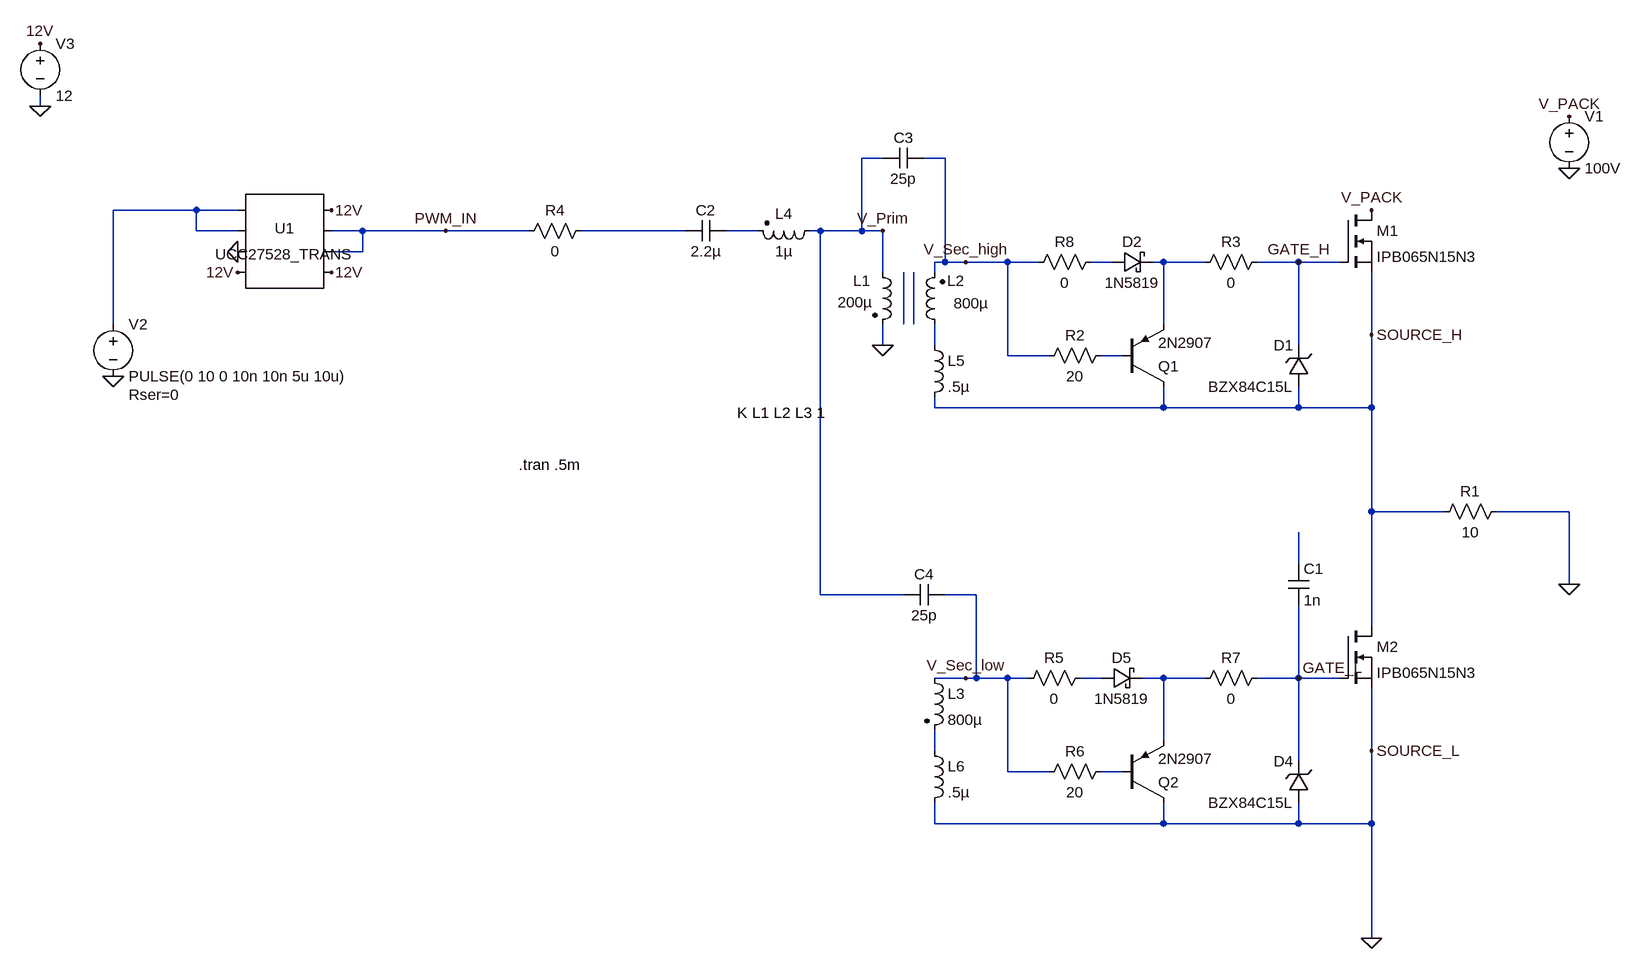
[diagram p0: schematic IsolatedGateDriver.asc]
IsolatedGateDriver.asc, the LTspice schematic file:
Version 4
SHEET 1 996 1044
WIRE -1440 -256 -1440 -272
WIRE -144 -176 -176 -176
WIRE -48 -176 -80 -176
WIRE -1200 -96 -1328 -96
WIRE -1136 -96 -1200 -96
WIRE -1200 -64 -1200 -96
WIRE -1136 -64 -1200 -64
WIRE -944 -64 -992 -64
WIRE -816 -64 -944 -64
WIRE -688 -64 -816 -64
WIRE -448 -64 -608 -64
WIRE -336 -64 -384 -64
WIRE -240 -64 -256 -64
WIRE -176 -64 -176 -176
WIRE -176 -64 -240 -64
WIRE -144 -64 -176 -64
WIRE -944 -32 -944 -64
WIRE -944 -32 -992 -32
WIRE -48 -16 -48 -176
WIRE -48 -16 -64 -16
WIRE -16 -16 -48 -16
WIRE 48 -16 -16 -16
WIRE 96 -16 48 -16
WIRE 208 -16 176 -16
WIRE 288 -16 272 -16
WIRE 352 -16 288 -16
WIRE 496 -16 432 -16
WIRE 560 -16 496 -16
WIRE -144 0 -144 -64
WIRE -64 0 -64 -16
WIRE -1328 80 -1328 -96
WIRE -112 80 -112 0
WIRE -96 80 -96 0
WIRE 288 80 288 -16
WIRE 608 96 608 0
WIRE -144 112 -144 80
WIRE -64 112 -64 80
WIRE 496 112 496 -16
WIRE 48 128 48 -16
WIRE 112 128 48 128
WIRE 224 128 192 128
WIRE -64 208 -64 192
WIRE 288 208 288 176
WIRE 288 208 -64 208
WIRE 496 208 496 176
WIRE 496 208 288 208
WIRE 608 208 608 96
WIRE 608 208 496 208
WIRE 608 368 608 208
WIRE 720 368 608 368
WIRE 912 368 800 368
WIRE 496 448 496 400
WIRE 912 480 912 368
WIRE -240 496 -240 -64
WIRE -112 496 -240 496
WIRE 0 496 -48 496
WIRE 608 544 608 368
WIRE -16 624 -64 624
WIRE 0 624 0 496
WIRE 0 624 -16 624
WIRE 48 624 0 624
WIRE 80 624 48 624
WIRE 192 624 160 624
WIRE 288 624 256 624
WIRE 352 624 288 624
WIRE 496 624 496 512
WIRE 496 624 432 624
WIRE 560 624 496 624
WIRE 288 720 288 624
WIRE -64 736 -64 704
WIRE 608 736 608 640
WIRE 496 752 496 624
WIRE 48 768 48 624
WIRE 112 768 48 768
WIRE 224 768 192 768
WIRE -64 848 -64 816
WIRE 288 848 288 816
WIRE 288 848 -64 848
WIRE 496 848 496 816
WIRE 496 848 288 848
WIRE 608 848 608 736
WIRE 608 848 496 848
WIRE 608 1024 608 848
FLAG -144 112 0
FLAG 912 -160 0
FLAG 912 -240 V_PACK
FLAG 608 -96 V_PACK
FLAG -1328 160 0
FLAG -816 -64 PWM_IN
FLAG 496 -16 GATE_H
FLAG 608 96 SOURCE_H
FLAG -144 -64 V_Prim
FLAG -16 -16 V_Sec_high
FLAG 608 1024 0
FLAG 496 624 GATE_L
FLAG 608 736 SOURCE_L
FLAG -16 624 V_Sec_low
FLAG 912 480 0
FLAG -1440 -256 0
FLAG -1440 -352 12V
FLAG -992 0 12V
FLAG -1136 -32 0
FLAG -1136 0 12V
FLAG -992 -96 12V
SYMBOL ind2 -160 -16 R0
WINDOW 0 -29 29 Left 2
WINDOW 3 -53 62 Left 2
SYMATTR InstName L1
SYMATTR Value 200µ
SYMATTR Type ind
SYMATTR SpiceLine Rser=.001
SYMBOL ind2 -48 96 R180
WINDOW 0 -30 83 Left 2
WINDOW 3 -67 49 Left 2
SYMATTR InstName L2
SYMATTR Value 800µ
SYMATTR Type ind
SYMATTR SpiceLine Rser=.02
SYMBOL res 816 352 R90
WINDOW 0 0 56 VBottom 2
WINDOW 3 32 56 VTop 2
SYMATTR InstName R1
SYMATTR Value 10
SYMBOL voltage 912 -256 R0
WINDOW 123 0 0 Left 2
WINDOW 39 0 0 Left 2
SYMATTR InstName V1
SYMATTR Value 100V
SYMBOL nmos 560 -96 R0
SYMATTR InstName M1
SYMATTR Value IPB065N15N3
SYMBOL zener 512 176 R180
WINDOW 0 24 64 Left 2
WINDOW 3 24 0 Left 2
SYMATTR InstName D1
SYMATTR Value BZX84C15L
SYMATTR Description Diode
SYMATTR Type diode
SYMBOL voltage -1328 64 R0
WINDOW 123 0 0 Left 2
WINDOW 39 24 124 Left 2
SYMATTR SpiceLine Rser=0
SYMATTR InstName V2
SYMATTR Value PULSE(0 10 0 10n 10n 5u 10u)
SYMBOL cap -384 -80 R90
WINDOW 0 0 32 VBottom 2
WINDOW 3 32 32 VTop 2
SYMATTR InstName C2
SYMATTR Value 2.2µ
SYMBOL schottky 208 0 R270
WINDOW 0 32 32 VTop 2
WINDOW 3 0 32 VBottom 2
SYMATTR InstName D2
SYMATTR Value 1N5819
SYMATTR Description Diode
SYMATTR Type diode
SYMBOL pnp 224 176 M180
SYMATTR InstName Q1
SYMATTR Value 2N2907
SYMBOL res 208 112 R90
WINDOW 0 0 56 VBottom 2
WINDOW 3 32 56 VTop 2
SYMATTR InstName R2
SYMATTR Value 20
SYMBOL res 448 -32 R90
WINDOW 0 0 56 VBottom 2
WINDOW 3 32 56 VTop 2
SYMATTR InstName R3
SYMATTR Value 0
SYMBOL res -592 -80 R90
WINDOW 0 0 56 VBottom 2
WINDOW 3 32 56 VTop 2
SYMATTR InstName R4
SYMATTR Value 0
SYMBOL ind2 -240 -80 R90
WINDOW 0 5 56 VBottom 2
WINDOW 3 32 56 VTop 2
SYMATTR InstName L4
SYMATTR Value 1µ
SYMATTR Type ind
SYMATTR SpiceLine Rpar=40m
SYMBOL ind2 -80 608 R0
SYMATTR InstName L3
SYMATTR Value 800µ
SYMATTR Type ind
SYMATTR SpiceLine Rser=.02
SYMBOL nmos 560 544 R0
SYMATTR InstName M2
SYMATTR Value IPB065N15N3
SYMBOL zener 512 816 R180
WINDOW 0 24 64 Left 2
WINDOW 3 24 0 Left 2
SYMATTR InstName D4
SYMATTR Value BZX84C15L
SYMATTR Description Diode
SYMATTR Type diode
SYMBOL schottky 192 640 R270
WINDOW 0 32 32 VTop 2
WINDOW 3 0 32 VBottom 2
SYMATTR InstName D5
SYMATTR Value 1N5819
SYMATTR Description Diode
SYMATTR Type diode
SYMBOL pnp 224 816 M180
SYMATTR InstName Q2
SYMATTR Value 2N2907
SYMBOL res 208 752 R90
WINDOW 0 0 56 VBottom 2
WINDOW 3 32 56 VTop 2
SYMATTR InstName R6
SYMATTR Value 20
SYMBOL res 448 608 R90
WINDOW 0 0 56 VBottom 2
WINDOW 3 32 56 VTop 2
SYMATTR InstName R7
SYMATTR Value 0
SYMBOL cap 480 448 R0
SYMATTR InstName C1
SYMATTR Value 1n
SYMBOL cap -80 -192 R90
WINDOW 0 0 32 VBottom 2
WINDOW 3 32 32 VTop 2
SYMATTR InstName C3
SYMATTR Value 25p
SYMBOL cap -48 480 R90
WINDOW 0 0 32 VBottom 2
WINDOW 3 32 32 VTop 2
SYMATTR InstName C4
SYMATTR Value 25p
SYMBOL res 64 640 R270
WINDOW 0 32 56 VTop 2
WINDOW 3 0 56 VBottom 2
SYMATTR InstName R5
SYMATTR Value 0
SYMBOL res 192 -32 R90
WINDOW 0 0 56 VBottom 2
WINDOW 3 32 56 VTop 2
SYMATTR InstName R8
SYMATTR Value 0
SYMBOL AutoGenerated\\UCC27528_TRANS -1072 -48 R0
SYMATTR InstName U1
SYMBOL voltage -1440 -368 R0
WINDOW 123 0 0 Left 0
WINDOW 39 0 0 Left 0
SYMATTR InstName V3
SYMATTR Value 12
SYMBOL ind -80 96 R0
SYMATTR InstName L5
SYMATTR Value .5µ
SYMBOL ind -80 720 R0
SYMATTR InstName L6
SYMATTR Value .5µ
TEXT -704 296 Left 2 !.tran .5m
TEXT -368 216 Left 2 !K L1 L2 L3 1

The netlist it stands for:
* IsolatedGateDriver.asc
L1 V_Prim 0 200µ Rser=.001
L2 N008 V_Sec_high 800µ Rser=.02
R1 0 SOURCE_H 10
V1 V_PACK 0 100V
M1 V_PACK GATE_H SOURCE_H SOURCE_H IPB065N15N3
D1 SOURCE_H GATE_H BZX84C15L
V2 N001 0 PULSE(0 10 0 10n 10n 5u 10u) Rser=0
C2 N003 N002 2.2µ
D2 N004 N005 1N5819
Q1 SOURCE_H N009 N005 0 2N2907
R2 N009 V_Sec_high 20
R3 GATE_H N005 0
R4 N002 PWM_IN 0
L4 V_Prim N003 1µ Rpar=40m
L3 V_Sec_low N013 800µ Rser=.02
M2 SOURCE_H GATE_L 0 0 IPB065N15N3
D4 0 GATE_L BZX84C15L
D5 N011 N012 1N5819
Q2 0 N014 N012 0 2N2907
R6 N014 V_Sec_low 20
R7 GATE_L N012 0
C1 N010 GATE_L 1n
C3 V_Sec_high V_Prim 25p
C4 V_Sec_low V_Prim 25p
R5 V_Sec_low N011 0
R8 N004 V_Sec_high 0
* U1: UCC27528_TRANS (symbol AutoGenerated\UCC27528_TRANS not available, pins judged from their places): pin1=N001 pin2=N001 pin3=0 pin4=12V pin5=12V pin6=PWM_IN pin7=PWM_IN pin8=12V
V3 12V 0 12
L5 N008 SOURCE_H .5µ
L6 N013 0 .5µ
.model D D
.lib standard.dio
.model NPN NPN
.model PNP PNP
.lib standard.bjt
.model NMOS NMOS
.model PMOS PMOS
.lib standard.mos
.tran .5m
K L1 L2 L3 1
.backanno
.end